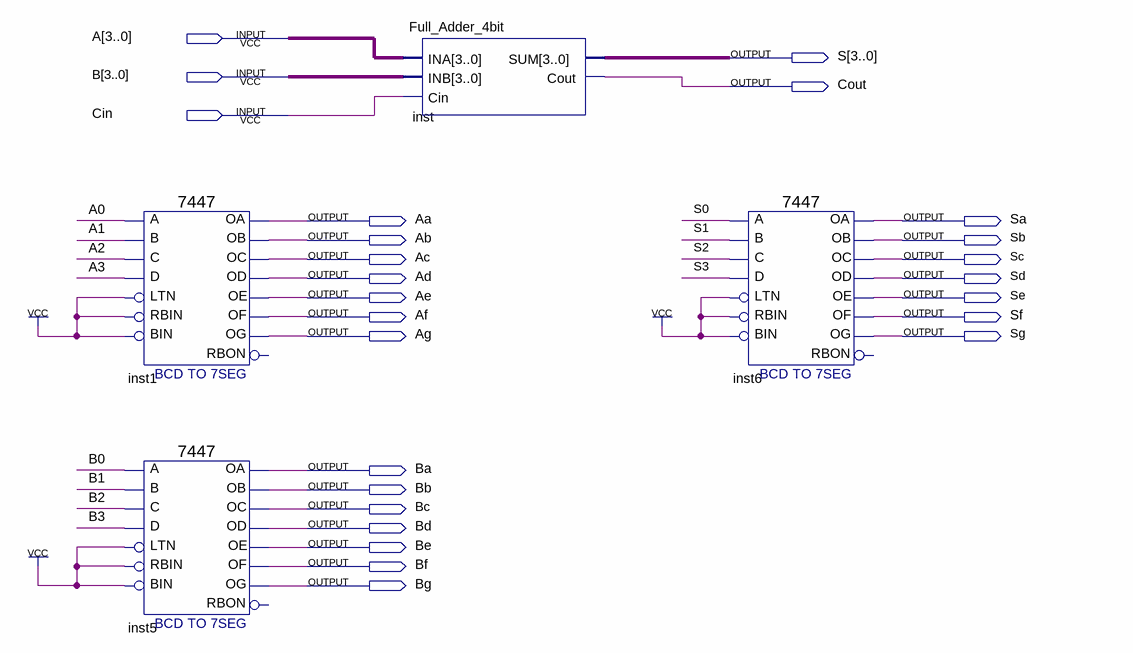
[diagram p0: schematic sheet]
// Quartus schematic Adder_4b.bdf as structural Verilog: 4 symbols, 26 pins
module Adder_4b (
  input  [3:0] A,
  input  [3:0] B,
  input  Cin,
  output [3:0] S,
  output Cout,
  output Aa,
  output Sa,
  output Ab,
  output Sb,
  output Ac,
  output Sc,
  output Ad,
  output Sd,
  output Ae,
  output Se,
  output Af,
  output Sf,
  output Ag,
  output Sg,
  output Ba,
  output Bb,
  output Bc,
  output Bd,
  output Be,
  output Bf,
  output Bg
);

  \7447  inst1 (
    .LTN(1'b1), .B(A[1]), .C(A[2]), .D(A[3]), .RBIN(1'b1), .BIN(1'b1), .A(A[0]), .OB(Ab), .OC(Ac), .OE(Ae),
    .OD(Ad), .OF(Af), .OG(Ag), .OA(Aa));  // open: RBON
  \7447  inst5 (
    .LTN(1'b1), .B(B[1]), .C(B[2]), .D(B[3]), .RBIN(1'b1), .BIN(1'b1), .A(B[0]), .OB(Bb), .OC(Bc), .OE(Be),
    .OD(Bd), .OF(Bf), .OG(Bg), .OA(Ba));  // open: RBON
  Full_Adder_4bit inst (.INA(A), .INB(B), .Cin(Cin), .SUM(S), .Cout(Cout));
  \7447  inst6 (
    .LTN(1'b1), .B(S[1]), .C(S[2]), .D(S[3]), .RBIN(1'b1), .BIN(1'b1), .A(S[0]), .OB(Sb), .OC(Sc), .OE(Se),
    .OD(Sd), .OF(Sf), .OG(Sg), .OA(Sa));  // open: RBON
endmodule
